# Altium schematic sheet Schematic TBv1 SM2.SchDoc
size A3; SheetNumber: 1; SheetTotal: 1
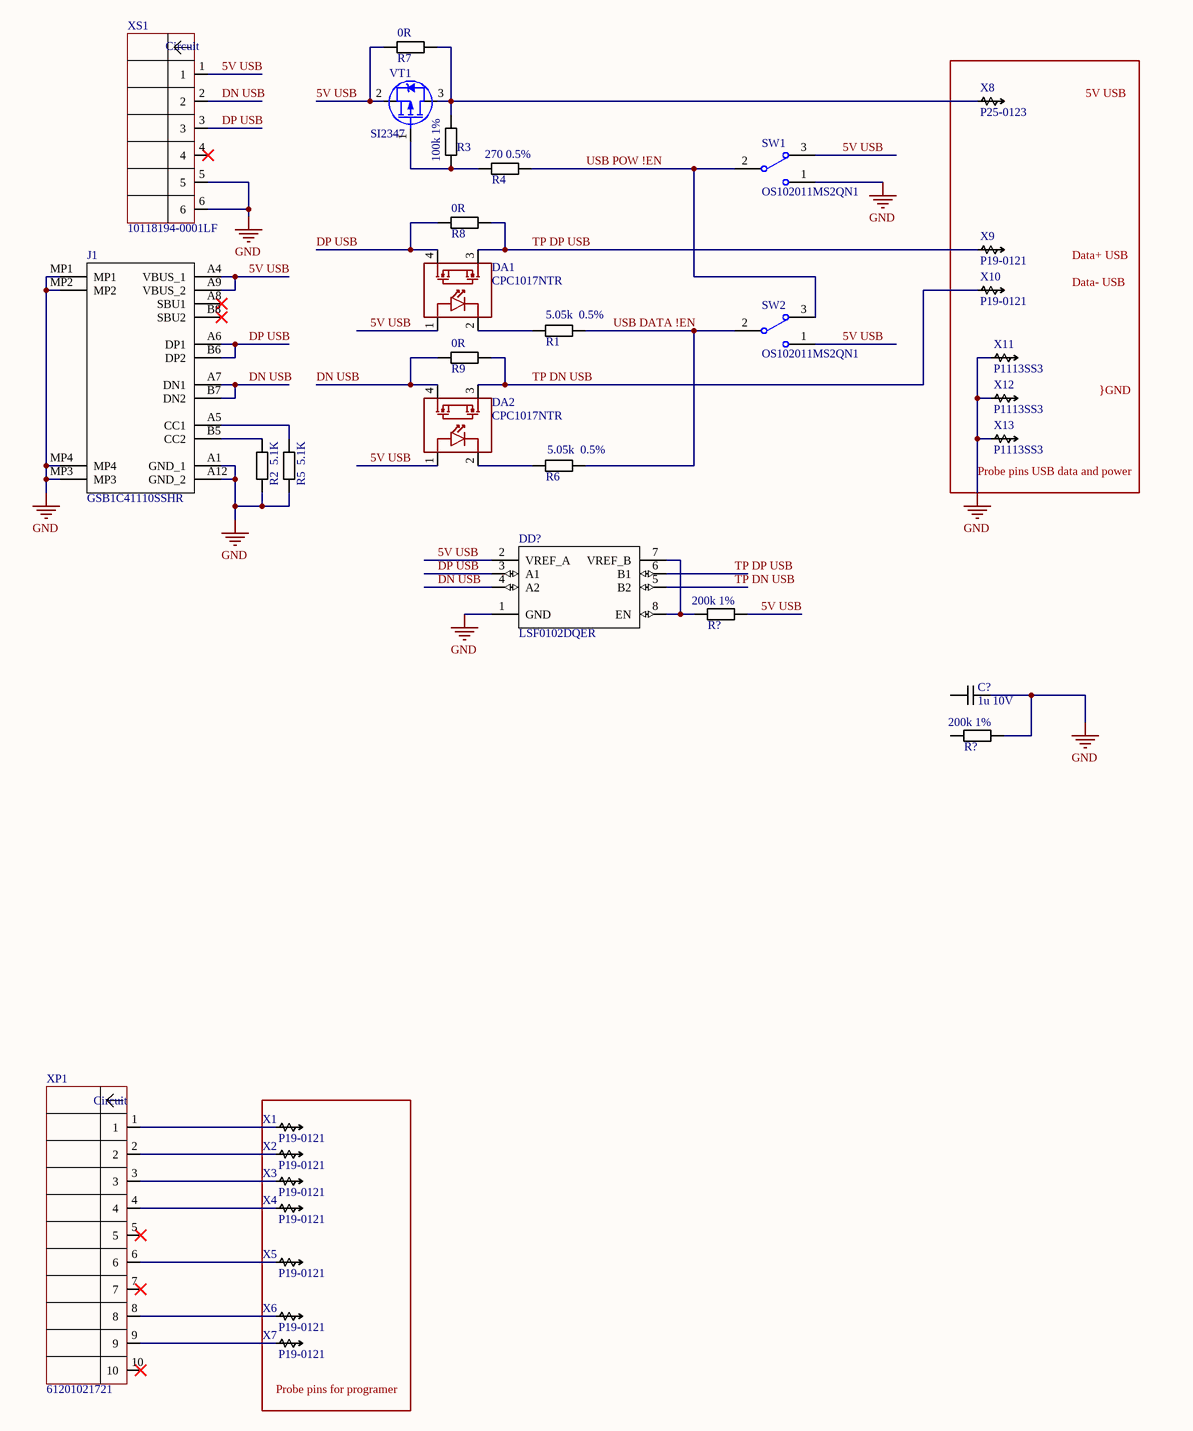
[diagram p0: Schematic TBv1 SM2.SchDoc]

## Parts
(Parts that share a designator on the sheet are numbered #1, #2 ... from top to bottom, then left to right.)
C?  1u 10V  [CAPC1608(0603)N]
DA1  CPC1017NTR  [SOP4_M]
DA2  CPC1017NTR  [SOP4_M]
DD?  LSF0102DQER  [LSF0102DQER]
J1  GSB1C41110SSHR  [GSB1C41110SSHR]
R1  5.05k  0.5%  [RESC1608(0603)N]
R2  5.1K  [RESC1608(0603)N]
R3  100k 1%  [RESC1608(0603)N]
R4  270 0.5%  [RESC1608(0603)N]
R5  5.1K  [RESC1608(0603)N]
R6  5.05k  0.5%  [RESC1608(0603)N]
R7  0R  [RESC1608(0603)N]  (no BOM)
R8  0R  [RESC1608(0603)N]  (no BOM)
R9  0R  [RESC1608(0603)N]  (no BOM)
R?#1  200k 1%  [RESC1608(0603)N]
R?#2  200k 1%  [RESC1608(0603)N]
SW1  OS102011MS2QN1  [OS102011MS2QN1]
SW2  OS102011MS2QN1  [OS102011MS2QN1]
VT1  SI2347  [SOT23-3N]
X1  P19-0121  [P19-0121]
X2  P19-0121  [P19-0121]
X3  P19-0121  [P19-0121]
X4  P19-0121  [P19-0121]
X5  P19-0121  [P19-0121]
X6  P19-0121  [P19-0121]
X7  P19-0121  [P19-0121]
X8  P25-0123  [P25-0123]
X9  P19-0121  [P19-0121]
X10  P19-0121  [P19-0121]
X11  P1113SS3  [P1113SS3]
X12  P1113SS3  [P1113SS3]
X13  P1113SS3  [P1113SS3]
XP1  61201021721  [BH-10R]
XS1  10118194-0001LF  [MICRO_USB _B]

## Blocks framed on the sheet
Probe pins for programer: X1-X7

## Nets
GND: C?.2 DD?.1(GND) J1.A1(GND_1) J1.A12(GND_2) J1.MP1 J1.MP2 J1.MP3 J1.MP4 R2.1 R5.1 R?#2.1 SW1.1 X11.1 X12.1 X13.1 XS1.5 XS1.6
5V USB: DA1.1 DA2.1 DD?.2(VREF_A) J1.A4(VBUS_1) J1.A9(VBUS_2) R7.1 R?#1.1 SW1.3 SW2.1 VT1.2(S) XS1.1
DN USB: DA2.4 DD?.4(A2) J1.A7(DN1) J1.B7(DN2) R9.1 XS1.2
DP USB: DA1.4 DD?.3(A1) J1.A6(DP1) J1.B6(DP2) R8.1 XS1.3
TP DN USB: DA2.3 DD?.5(B2) R9.2 X10.1
TP DP USB: DA1.3 DD?.6(B1) R8.2 X9.1
USB DATA !EN: R1.2 R6.2 SW2.2
USB POW !EN: R4.2 SW1.2 SW2.3
NetDA1_2: DA1.2 R1.1
NetDA2_2: DA2.2 R6.1
NetDD?_7: DD?.7(VREF_B) DD?.8(EN) R?#1.2
NetJ1_A5: J1.A5(CC1) R5.2
NetJ1_B5: J1.B5(CC2) R2.2
NetR3_1: R3.1 R4.1 VT1.1(G)
NetR3_2: R3.2 R7.2 VT1.3(D) X8.1
NetX1_1: X1.1 XP1.1
NetX2_1: X2.1 XP1.2
NetX3_1: X3.1 XP1.3
NetX4_1: X4.1 XP1.4
NetX5_1: X5.1 XP1.6
NetX6_1: X6.1 XP1.8
NetX7_1: X7.1 XP1.9

Not connected (* = marked no-connect by the designer): C? 1; J1 A8(SBU1)* B8(SBU2)*; R?#2 2; XP1 5* 7* 10*; XS1 4*

## Notes on the sheet
- 5V USB
- Data+ USB
- Data- USB
- }GND
- (near X13) Probe pins USB data and power
- (in symbol 10118194-0001LF) Circuit
- (in symbol 61201021721) Circuit

## Library data of the parts
C? = C0603C105K8PACTU: Cap Cer MLCC SMD 1uF 10V X7R 10%; Part Number: C0603C105K8PACTU; HelpURL: https://www.mouser.co.uk/ProductDetail/KEMET/C0603C105K8PACTU?qs=sGAEpiMZZMsh%252B1woXyUXj0sdcx8ua6NEbP9YG1gNGS4%3D; Price$: 0.013; Manufacturer Part Number: C0603C105K8PACTU; Package: 0603; Mouser Part Number: 80-C0603C105K8P
DD? = LSF0102DQER: IC TRANSLTR BIDIRECTIONAL 8X2SON; Manufacturer_Name: Texas Instruments; Manufacturer_Part_Number: LSF0204PWR; Datasheet Link: http://www.ti.com/lit/gpn/lsf0204; Height: 1.2mm; Mouser Part Number: 595-LSF0204PWR; Mouser Price/Stock: https://www.mouser.co.uk/ProductDetail/Texas-Instruments/LSF0204PWR?qs=m%2F7bTylgptck0MkFZrWcVg%3D%3D; Arrow Part Number: LSF0204PWR; Arrow Price/Stock: https://www.arrow.com/en/products/lsf0204pwr/texas-instruments?region=nac; Part Number: LSF0102DQER; HelpURL: https://www.digikey.com/en/products/detail/texas-instruments/LSF0102DQER/4806526; Digi-Key Part Number: 296-40399-1-ND; Manufacturer Part Number: LSF0102DQER
J1 = GSB1C41110SSHR: USB-C (USB TYPE-C) USB 2.0 Receptacle Connector 24 (16+8 Dummy) Position Surface Mount, Right Angle; Through Hole; Manufacturer_Name: Amphenol Communications Solutions; Datasheet Link: https://cdn.amphenol-cs.com/media/wysiwyg/files/drawing/gsb1c41x10sshr-ax1.pdf; Height: 3.41mm; Manufacturer_Part_Number: GSB1C41110SSHR; Part Number: GSB1C41110SSHR; HelpURL: https://www.digikey.com/en/products/detail/amphenol-cs-commercial-products/GSB1C41110SSHR/21623839; Digi-Key Part Number: 664-GSB1C41110SSHRCT-ND; Price$: 0.69
R1 R2 R5 R6 = RT0603DRE075K05L: RES SMD 0603 5.05k  0.5% 50ppm; Part Number: RT0603DRE075K05L; HelpURL: https://eu.mouser.com/ProductDetail/Yageo/RT0603DRE075K05L?qs=sGAEpiMZZMvdGkrng054ty4ODOmm8zHWHBV5lfFAoxEMDaTsVBXQvg%3D%3D; Manufacturer Part Number: RT0603DRE075K05L; Package: 0603; Mouser Part Number: 603-RT0603DRE075K05L
R3 = CRCW0603100KFKEAC: RES SMD 0603 100k 1% 100ppm; Part Number: CRCW0603100KFKEAC; HelpURL: https://www.digikey.com/en/products/detail/vishay-dale/CRCW0603100KFKEAC/7928372?s=N4IgTCBcDaIMICU4HUAMA2VBmAjK1A0gGIECiAgnCALoC%2BQA; Price$: 0.005; Manufacturer Part Number: CRCW0603100KFKEAC; Package: 0603; Mouser Part Number: 71-CRCW0603100KFKEAC
R4 = RT0603DRD07270RL: RES SMD 0603 270 0.5% 25ppm; Part Number: RT0603DRD07270RL; HelpURL: https://eu.mouser.com/ProductDetail/Yageo/RT0603DRD07270RL?qs=sGAEpiMZZMvdGkrng054t%252BSYh%252B1gqt95WSNs3ZJeOm0%3D; Manufacturer Part Number: RT0603DRD07270RL; Package: 0603; Mouser Part Number: 603-RT0603DRD07270RL
R7-R9 = CRCW06030000Z0EBC: RES SMD 0603 0R  0ppm; Part Number: CRCW06030000Z0EBC; HelpURL: https://eu.mouser.com/ProductDetail/Vishay-Dale/CRCW06030000Z0EBC?qs=sGAEpiMZZMvdGkrng054tz1y1XEHv7sNVER0fX3d2gqrK9Uftz5%252BlA%3D%3D; Manufacturer Part Number: CRCW06030000Z0EBC; Package: 0603; Mouser Part Number: 71-CRCW06030000Z0EBC
R?#1 R?#2 = RT0603FRE07200KL: RES SMD 0603 200k 1% 50ppm; Part Number: RT0603FRE07200KL; HelpURL: https://eu.mouser.com/ProductDetail/Yageo/RT0603FRE07200KL?qs=sGAEpiMZZMvdGkrng054t%252BKCHBXLTLydxo1lsRACSOE%3D; Manufacturer Part Number: RT0603FRE07200KL; Package: 0603; Mouser Part Number: 603-RT0603FRE07200KL
SW1 SW2 = OS102011MS2QN1: SWITCH SLIDE SPDT 100MA 12V; ComponentLink1Description: Manufacturer Link; ComponentLink1URL: http://www.apem.com; Part Number: OS102011MS2QN1; HelpURL: https://www.digikey.com/product-detail/en/c-k/OS102011MS2QN1/CKN9565-ND/411602; Digi-Key Part Number: CKN9565-ND; Manufacturer Part Number: OS102011MS2QN1
VT1 = SI2347DS-T1-GE3: MOSFET P-CH 30V 5A SOT23-3; Part Number: SI2347DS-T1-GE3; HelpURL: https://www.digikey.ro/en/products/detail/vishay-siliconix/SI2347DS-T1-GE3/5805425; Digi-Key Part Number: SI2347DS-T1-GE3CT-ND; Price$: 0.41; Manufacturer Part Number: SI2347DS-T1-GE3
X1-X7 X9 X10 = P19-0121: 1.90MM CENTER TWO PART PROBE; Part Number: P19-0121; HelpURL: https://www.digikey.ro/en/products/detail/harwin-inc/P19-0121/3924405?s=N4IgTCBcDaIAoEYCcBaADAsCQF0C%2BQA; Digi-Key Part Number: 952-2603-ND; Price$: 3.95; Manufacturer Part Number: P19-0121
X8 = P25-0123: 2.54MM CENTER TWO PART PROBE; Part Number: P25-0123; HelpURL: https://www.digikey.com/en/products/detail/harwin-inc/P25-0123/3727855; Price$: 2.71; Manufacturer Part Number: P25-0123
X11-X13 = P1113SS3: CONTACT SPRING LOADED T/H GOLD; Part Number: P1113SS3; HelpURL: https://www.digikey.com/en/products/detail/harwin-inc/P1113SS3/6797761; Digi-Key Part Number: 952-3572-ND; Price$: 4.65; Manufacturer Part Number: P1113SS3
XP1 = 61201021721: (BH-10)Headers & Wire Housings WR-BHD 2.54mm Box 10Pin Male Angled; Part Number: 61201021721; HelpURL: https://eu.mouser.com/ProductDetail/Wurth-Elektronik/61201021721?qs=sGAEpiMZZMs%252BGHln7q6pm%252BxnWLfLL2%2F9eOMUL6byRsM%3D; Price$: 0.494; Manufacturer Part Number: 61201021721; Package: Header 10POS 2.54mm; Mouser Part Number: 710-61201021721
XS1 = 10118194-0001LF: USB Connectors 5P MICRO USB TYPE B RCPT W/ REAR PEGS; Part Number: 10118194-0001LF; HelpURL: https://eu.mouser.com/ProductDetail/Amphenol-FCI/10118194-0001LF?qs=%2Fha2pyFadugHQYubHEjQrWaf71KglMlHbfZ%2FBmSxIoqAM0lAnkBayw%3D%3D; Digi-Key Part Number: 609-4618-1-ND; Price$: 0.265; Manufacturer Part Number: 10118194-0001LF; Mouser Part Number: 649-10118194-0001LF
DA1 DA2 = CPC1017NTR: Part Number: CPC1017NTR; HelpURL: http://eu.mouser.com/ProductDetail/IXYS-Integrated-Circuits/CPC1017NTR/?qs=sGAEpiMZZMsUriz2CNI3E0bxyj4gwKaXtYmZsEcLV08%3d